# Altium schematic sheet Sheet1.SchDoc
size A4
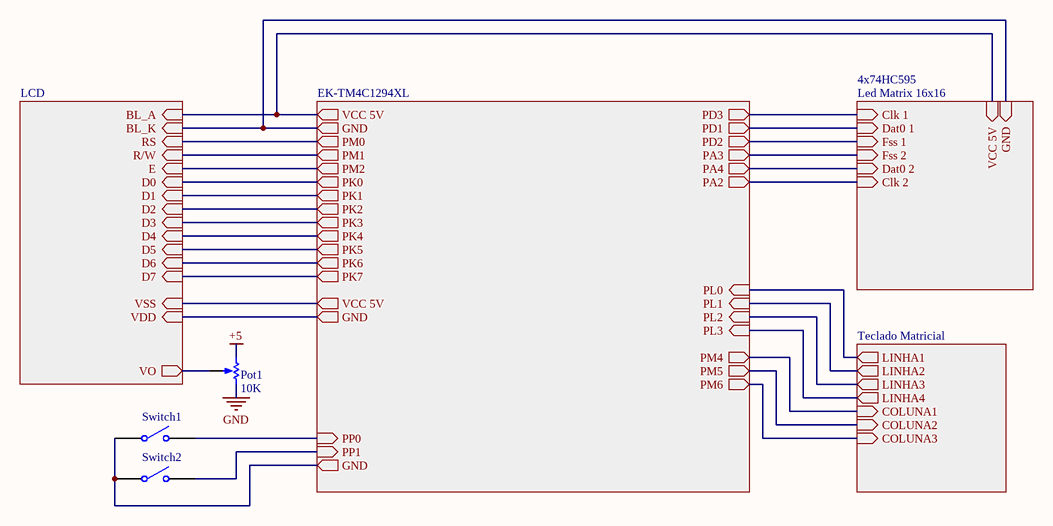
[diagram p0: Sheet1.SchDoc]

## Parts
?  Pot1  value 10K  [VR5]
Switch1  SW-SPST  [SPST-2]  (value not drawn)
Switch2  W-SPST  [SPST-2]  (value not drawn)

## Sub-sheets
4x74HC595 = Led Matrix 16x16: Clk 1 (in), Dat0 1 (in), Fss 1 (in), Fss 2 (in), Dat0 2 (in), Clk 2 (in), VCC 5V (in), GND (in)
Designator = EK-TM4C1294XL: VCC 5V (out), GND (out), PM0 (out), PM1 (out), PM2 (out), PK0 (out), PK1 (out), PK2 (out), PK3 (out), PK4 (out), PK5 (out), PK6 (out), PK7 (out), PD1 (out), PD2 (out), PD3 (out), PA3 (out), PA4 (out), PA2 (out), PL0 (in), PL1 (in), PL2 (in), PL3 (in), PM4 (out), PM5 (out), PM6 (out), PP1 (in), PP0 (in), GND (out), GND (out), VCC 5V (out)
Designator = LCD: BL_A (in), BL_K (in), RS (in), R/W (in), E (in), D0 (in), D1 (in), D2 (in), D3 (in), D4 (in), D5 (in), D6 (in), D7 (in), VSS (in), VDD (in), VO (out)
Designator = Teclado Matricial: LINHA1 (out), LINHA2 (out), LINHA3 (out), LINHA4 (out), COLUNA1 (in), COLUNA2 (in), COLUNA3 (in)

## Nets
+5: ?.1(TOP)
GND: ?.2(BOT)
Net?_3: ?.3(TAP) ; sheet Designator/VO
NetSwitch1_1: Switch1.1(COMMON) Switch2.1(COMMON) ; sheet Designator/GND
NetSwitch1_2: Switch1.2(NO) ; sheet Designator/PP0
NetSwitch2_2: Switch2.2(NO) ; sheet Designator/PP1
(unnamed): sheet Designator/VCC 5V, sheet Designator/BL_A, sheet 4x74HC595/VCC 5V
(unnamed): sheet Designator/GND, sheet Designator/BL_K, sheet 4x74HC595/GND
(unnamed): sheet Designator/PM0, sheet Designator/RS
(unnamed): sheet Designator/PM1, sheet Designator/R/W
(unnamed): sheet Designator/PM2, sheet Designator/E
(unnamed): sheet Designator/PK0, sheet Designator/D0
(unnamed): sheet Designator/PK1, sheet Designator/D1
(unnamed): sheet Designator/PK2, sheet Designator/D2
(unnamed): sheet Designator/PK3, sheet Designator/D3
(unnamed): sheet Designator/PK4, sheet Designator/D4
(unnamed): sheet Designator/PK5, sheet Designator/D5
(unnamed): sheet Designator/PK6, sheet Designator/D6
(unnamed): sheet Designator/PK7, sheet Designator/D7
(unnamed): sheet Designator/PD1, sheet 4x74HC595/Dat0 1
(unnamed): sheet Designator/PD2, sheet 4x74HC595/Fss 1
(unnamed): sheet Designator/PD3, sheet 4x74HC595/Clk 1
(unnamed): sheet Designator/PA3, sheet 4x74HC595/Fss 2
(unnamed): sheet Designator/PA4, sheet 4x74HC595/Dat0 2
(unnamed): sheet Designator/PA2, sheet 4x74HC595/Clk 2
(unnamed): sheet Designator/PL0, sheet Designator/LINHA1
(unnamed): sheet Designator/PL1, sheet Designator/LINHA2
(unnamed): sheet Designator/PL2, sheet Designator/LINHA3
(unnamed): sheet Designator/PL3, sheet Designator/LINHA4
(unnamed): sheet Designator/PM4, sheet Designator/COLUNA1
(unnamed): sheet Designator/PM5, sheet Designator/COLUNA2
(unnamed): sheet Designator/PM6, sheet Designator/COLUNA3
(unnamed): sheet Designator/GND, sheet Designator/VDD
(unnamed): sheet Designator/VCC 5V, sheet Designator/VSS

## Library data of the parts
? = RPot: Potentiometer; Sim Note: Enter the Resistance value and the set point into parameter fields.; Set Position: 0.5; Published: 8-Jun-2000; LatestRevisionDate: 17-Jul-2002; LatestRevisionNote: Re-released for DXP Platform.; PackageReference: VR5; Publisher: Altium Limited; PackageDescription: Variable Resistor, Thru-Hole; 3 Leads
Switch1 Switch2 = SW-SPST: Single-Pole, Single-Throw Switch; Published: 24-Mar-1999; LatestRevisionDate: 17-Jul-2002; LatestRevisionNote: Re-released for DXP Platform.; PackageReference: SPST-2; Publisher: Altium Limited; PackageDescription: Switch; 2 Leads